# EAGLE design PM_proto_2 (EAGLE 9.0.0)
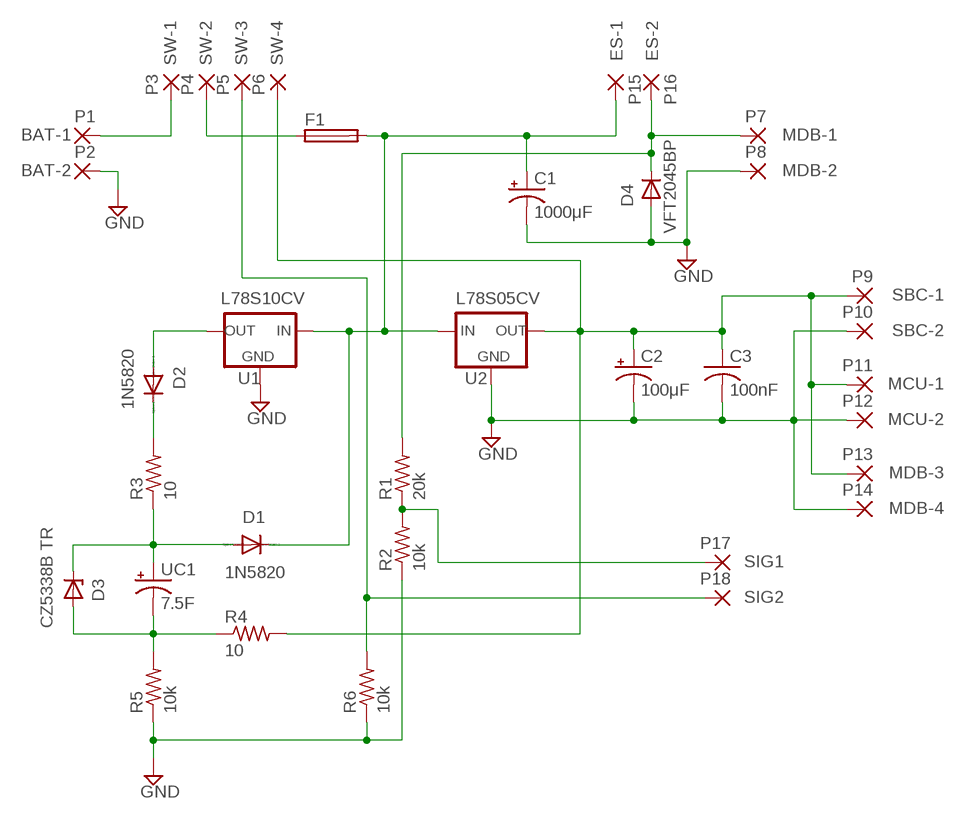
[diagram p0: schematic, sheet 1]

## Parts
C1  1000μF  CPOL-USE7.5-16  [E7,5-16]
C2  100μF  CPOL-USE2,5-6E  [E2,5-6E]
C3  100nF  C-US050-024X044  [C050-024X044]
D1  1N5820  1N4004  [DO41-10]
D2  1N5820  1N4004  [DO41-10]
D3  CZ5338B TR  1N4728  [DO41Z10]
D4  VFT2045BP  [VFT2045BP]
F1  0297015FUSE  [0297015HOLDER]
P1  BAT-1  1,6/0,8  [1,6/0,8]
P2  BAT-2  1,6/0,8  [1,6/0,8]
P3  SW-1  1,6/0,8  [1,6/0,8]
P4  SW-2  1,6/0,8  [1,6/0,8]
P5  SW-3  1,6/0,8  [1,6/0,8]
P6  SW-4  1,6/0,8  [1,6/0,8]
P7  MDB-1  1,6/0,8  [1,6/0,8]
P8  MDB-2  1,6/0,8  [1,6/0,8]
P9  SBC-1  1,6/0,8  [1,6/0,8]
P10  SBC-2  1,6/0,8  [1,6/0,8]
P11  MCU-1  1,6/0,8  [1,6/0,8]
P12  MCU-2  1,6/0,8  [1,6/0,8]
P13  MDB-3  1,6/0,8  [1,6/0,8]
P14  MDB-4  1,6/0,8  [1,6/0,8]
P15  ES-1  1,6/0,8  [1,6/0,8]
P16  ES-2  1,6/0,8  [1,6/0,8]
P17  SIG1  1,6/0,8  [1,6/0,8]
P18  SIG2  1,6/0,8  [1,6/0,8]
R1  20k  R-US_0204/7  [0204/7]
R2  10k  R-US_0204/7  [0204/7]
R3  10  TNP10SC10R0FE  [TNP10SC10R0FE]
R4  10  TNP10SC10R0FE  [TNP10SC10R0FE]
R5  10k  R-US_0204/7  [0204/7]
R6  10k  R-US_0204/7  [0204/7]
U1  L78S10CV  78XXS  [78XXS]
U2  L78S05CV  78XXS  [78XXS]
UC1  7.5F  SCMT32D755MRBB0  [SCMT32D755MRBB0]

## Nets
5VPWR: C2.+ C3.1 P6.1(P) P9.1(P) P11.1(P) P13.1(P) R4.2 U2.OUT
BATT_1: P1.1(P) P3.1(P)
BATT_2: F1.1 F1.2 P4.1(P)
BATT_3: C1.+ D1.C F1.3 F1.4 P15.1(P) U1.IN U2.IN
BATT_4: D4.1(C) P7.1(P) P16.1(P) R1.2
CAP_NEG: D3.A R4.1 R5.2 UC1.2(-)
CAP_POS: D1.A D3.C R3.1 UC1.1(+)
GND: C1.- C2.- C3.2 D4.2(A) P2.1(P) P8.1(P) P10.1(P) P12.1(P) P14.1(P) R2.1 R5.1 R6.1 U1.GND U2.GND
N$2: D2.A U1.OUT
N$3: D2.C R3.2
ON_SENSE: P5.1(P) P18.1(P) R6.2
V_SENSE: P17.1(P) R1.1 R2.2

## Library data of the parts
C1 C2 = rcl:CPOL-US: POLARIZED CAPACITOR, American symbol; SPICEPREFIX: C
C3 = rcl:C-US: CAPACITOR, American symbol; SPICEPREFIX: C
D1 D2 = diode:1N4004: DIODE general purpose rectifier, 1 A
D3 = diode:1N4728: Z DIODE 3.3 V, 1W, 5 percent
D4 = rasm_parts:VFT2045BP: Trench MOS Barrier Schottky Rectifier. 20A 0.51V.
F1 = rasm_parts:0297015FUSE: MINI Blade Fuse 0297xxx
P1-P18 = wirepad:1,6/0,8: THROUGH-HOLE PAD
R1 R2 R5 R6 = rcl:R-US_: RESISTOR, American symbol; SPICEPREFIX: R
R3 R4 = rasm_parts:TNP10SC10R0FE
U1 = v-reg:78XXS: VOLTAGE REGULATOR
U2 = v-reg:78XXS: VOLTAGE REGULATOR; SPICEPREFIX: J
UC1 = rasm_parts:SCMT32D755MRBB0: 5.4V 7.5F supercapacitor/ultracapacitor.

## Board
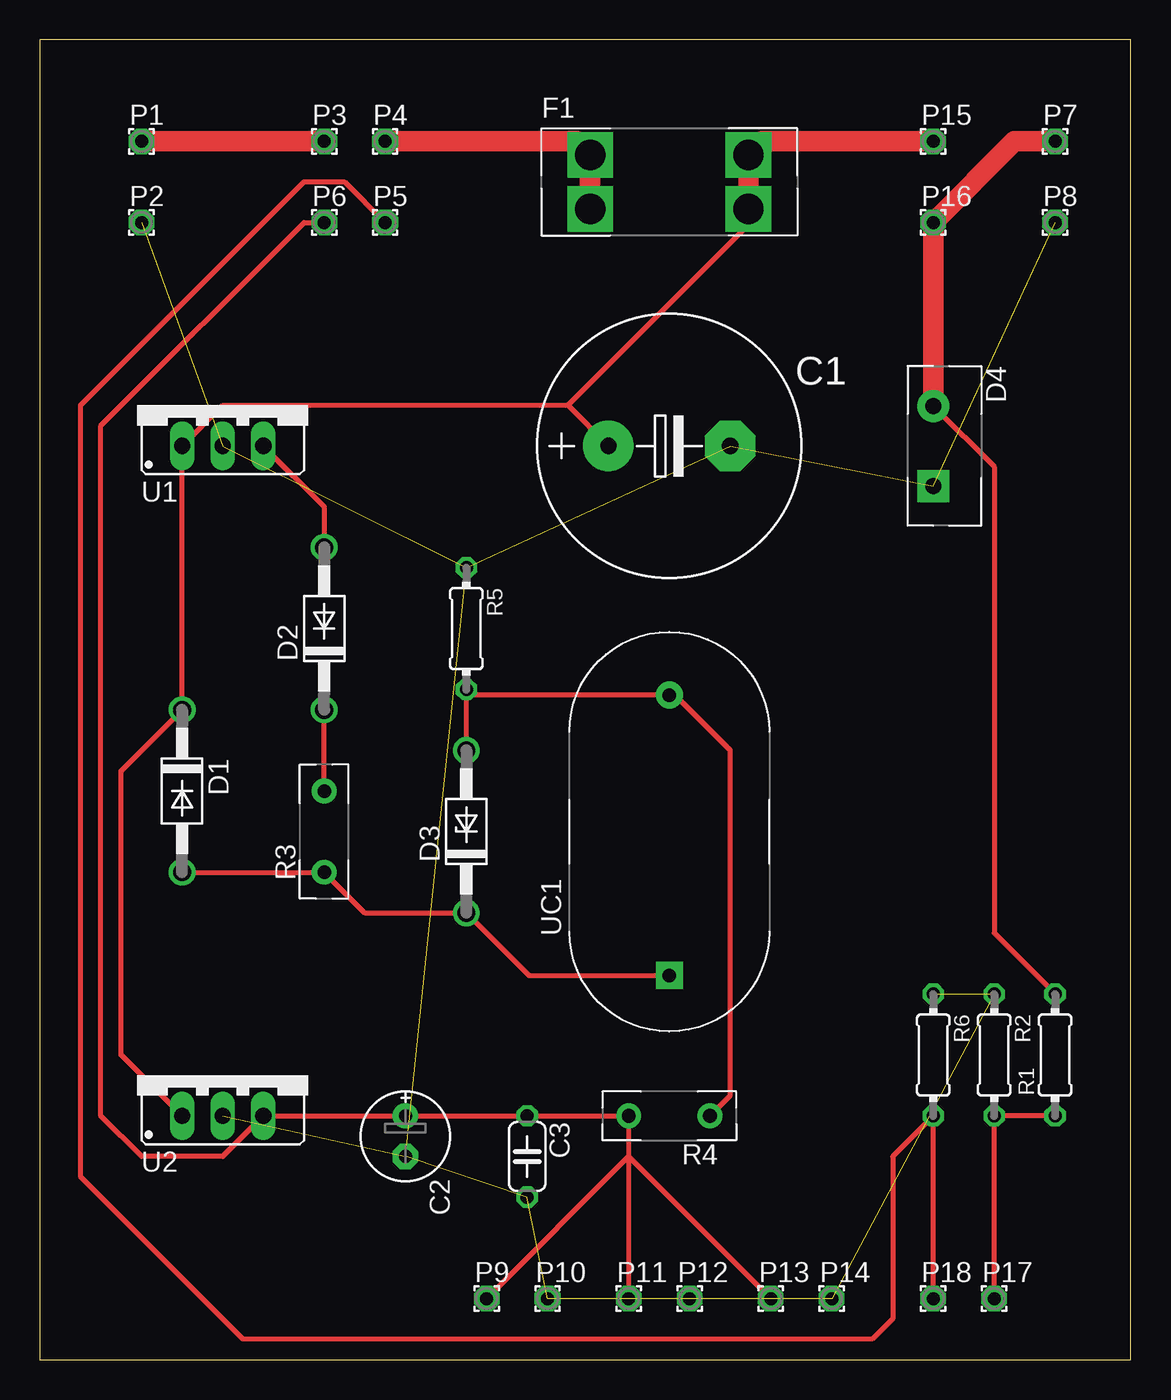
[diagram p1: board, top side]

Size 68.25 x 82.54 mm. Coordinates in mm from the lower left corner, seen from the top.
Outline: 0,0 68.25,0 68.25,82.54 0,82.54 0,0
Copper layers (1*16): Top 0.035mm / dielectric 1.5mm / Bottom 0.035mm
Design rules "default": minimum track width 6mil, minimum drill 0.35mm, track to track 6mil, track to pad 6mil, pad to pad 6mil, via to via 6mil, smd to smd 6mil, copper to edge 40mil, drill to drill 6mil, minimum pad ring 10mil, minimum via ring 8mil, stop-mask expansion 4mil, vias tented up to drill 0mil, thermal gap 10mil

### Footprints (pad centres in the part's own frame; a part is rotated, then mirrored left to right if it is on the bottom)
E7,5-16 = drill 1.016 pad 3.15: + -3.81,0 | drill 1.016 pad 3.15 octagon: - 3.81,0
E2,5-6E = drill 0.813 pad 1.575: + -1.27,0 | drill 0.813 pad 1.575 octagon: - 1.27,0
C050-024X044 = drill 0.813 octagon: 1 -2.54,0; 2 2.54,0
DO41-10 = drill 1.118: A 5.08,0; C -5.08,0
DO41Z10 = drill 1.118: A 5.08,0; C -5.08,0
VFT2045BP = drill 1 pad 2: 1 -2.5,0 | drill 1 pad 2 square: 2 2.5,0
0297015HOLDER = drill 1.9 pad 2.6 square: 1 -4.95,1.7; 2 -4.95,-1.7; 3 4.95,1.7; 4 4.95,-1.7
1,6/0,8 = drill 0.813 pad 1.6 octagon: 1 0,0
0204/7 = drill 0.813 octagon: 1 -3.81,0; 2 3.81,0
TNP10SC10R0FE = drill 0.85 pad 1.55: 1 -2.54,0; 2 2.54,0
78XXS = drill 1.016 long: GND 0,-2.54; IN -2.54,-2.54; OUT 2.54,-2.54
SCMT32D755MRBB0 = drill 0.85 pad 1.7 square: 1 -9,0 | drill 0.85 pad 1.7: 2 8.54,0

### Placement (x,y rotation side)
C1  39.37,57.15 0 top
C2  22.86,13.97 270 top
C3  30.48,12.7 270 top
D1  8.89,35.56 270 top
D2  17.78,45.72 90 top
D3  26.67,33.02 90 top
D4  55.88,57.15 270 top
F1  39.37,73.66 0 top
P1  6.35,76.2 0 top
P2  6.35,71.12 0 top
P3  17.78,76.2 0 top
P4  21.59,76.2 0 top
P5  21.59,71.12 0 top
P6  17.78,71.12 0 top
P7  63.5,76.2 0 top
P8  63.5,71.12 0 top
P9  27.94,3.81 0 top
P10  31.75,3.81 0 top
P11  36.83,3.81 0 top
P12  40.64,3.81 0 top
P13  45.72,3.81 0 top
P14  49.53,3.81 0 top
P15  55.88,76.2 0 top
P16  55.88,71.12 0 top
P17  59.69,3.81 0 top
P18  55.88,3.81 0 top
R1  63.5,19.05 90 top
R2  59.69,19.05 270 top
R3  17.78,33.02 90 top
R4  39.37,15.24 180 top
R5  26.67,45.72 270 top
R6  55.88,19.05 270 top
U1  11.43,59.69 0 top
U2  11.43,17.78 0 top
UC1  39.37,33.02 90 top

### Tracks (layer width: path | path; a pad name or v marks a point on that pad's centre or on a via)
5VPWR
  Top 0.305: 36.83,12.7 R4.2 C3.1 C2.+ U2.OUT 11.43,12.7 6.35,12.7 3.81,15.24 3.81,58.42 16.51,71.12 P6.1 | 36.83,12.7 P11.1 | P13.1 36.83,12.7 | P9.1 36.83,12.7
BATT_1
  Top 1.27: P3.1 P1.1
BATT_2
  Top 1.27: F1.2 F1.1 33.58,76.2 P4.1
BATT_3
  Top 0.305: U2.IN 5.08,19.05 5.08,36.83 D1.C U1.IN 11.43,59.69 33.02,59.69 | 33.02,59.69 C1.+ | F1.4 44.32,70.99 33.02,59.69
  Top 1.27: F1.4 F1.3 45.16,76.2 P15.1
BATT_4
  Top 0.305: D4.1 59.69,55.84 59.69,26.67 R1.2
  Top 1.27: P7.1 60.96,76.2 P16.1 D4.1
CAP_NEG
  Top 0.305: D3.A R5.2 27.02,41.56 UC1.2 39.72,41.56 43.18,38.1 43.18,16.51 R4.1
CAP_POS
  Top 0.305: D1.A R3.1 20.32,27.94 D3.C 30.59,24.02 UC1.1
GND  (13 unrouted)
N$2
  Top 0.305: U1.OUT 17.78,53.34 D2.A
N$3
  Top 0.305: R3.2 D2.C
ON_SENSE
  Top 0.305: P18.1 R6.2 53.34,12.7 53.34,2.54 52.07,1.27 12.7,1.27 2.54,11.43 2.54,59.69 16.51,73.66 19.05,73.66 P5.1
V_SENSE
  Top 0.305: R1.1 R2.2 P17.1